# Altium project MM6108IQ MotherBoard.PrjPcb
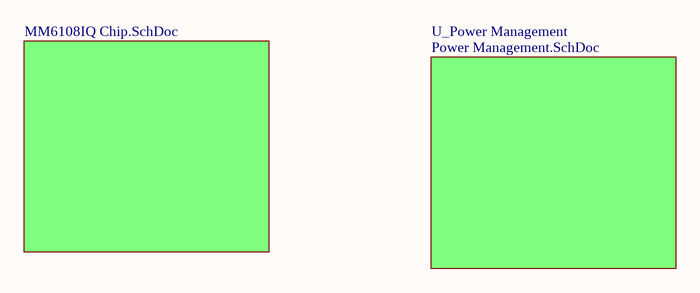
[diagram p0: MM6108IQ MotherBoard.SchDoc]
4 sheets, 74 parts. Net scope: flat (ports and power ports of the same name join across sheets).
Board file: MM6108IQ MotherBoard.PcbDoc
Sheets:
  MM6108IQ MotherBoard.SchDoc
    U_MM6108IQ MotherBoard = MM6108IQ Chip.SchDoc
    U_Power Management = Power Management.SchDoc
  Block Diagram.SchDoc

## Sheet MM6108IQ MotherBoard.SchDoc
size A; SheetNumber: 1; SheetTotal: 4

### Sub-sheets
U_MM6108IQ MotherBoard = MM6108IQ Chip.SchDoc: no entries
U_Power Management = Power Management.SchDoc: no entries

## Sheet MM6108IQ Chip.SchDoc
size 431 x 266 mm; SheetNumber: 2; SheetTotal: 4
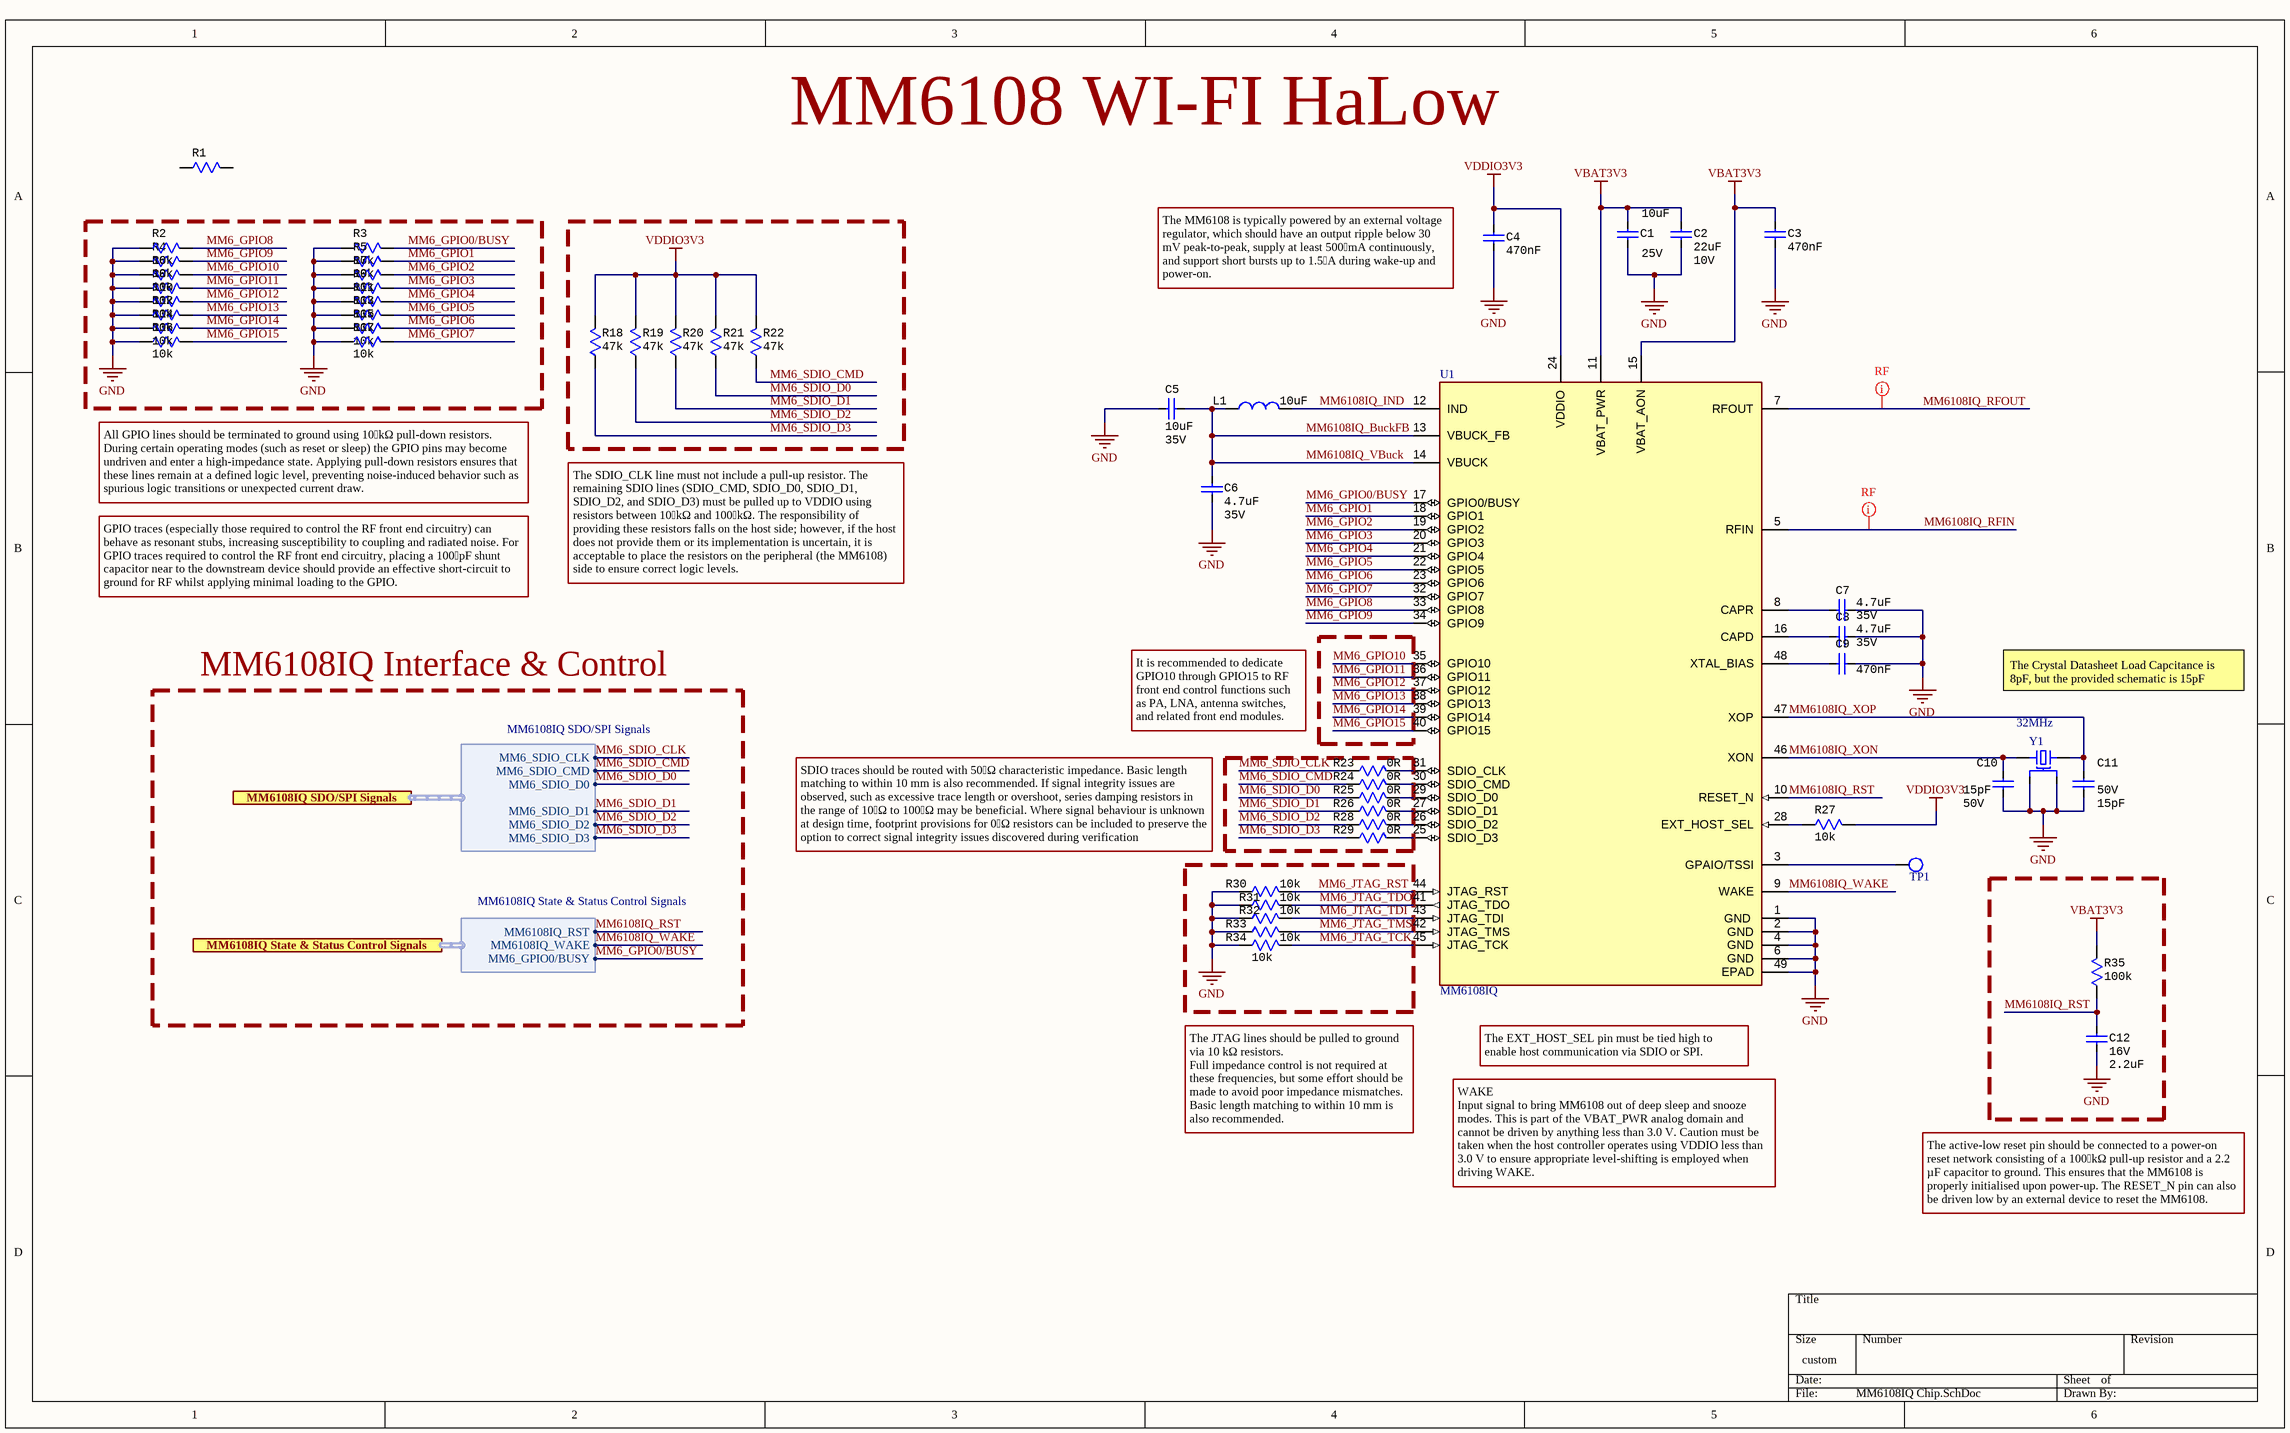
[diagram p1: MM6108IQ Chip.SchDoc]

### Parts
C1  Voltage: 25V  [CAP Ceramic SMD 0805]  (hidden comment: 10uF)
C2  Voltage: 10V  [CAP Ceramic SMD 0805]  (hidden comment: 22uF)
C3  470nF  [CAP Ceramic SMD 0603]
C4  470nF  [CAP Ceramic SMD 0603]
C5  Voltage: 35V  [CAP Ceramic SMD 0603]  (hidden comment: 10uF)
C6  value 4.7uF  Voltage: 35V  [CAP Ceramic SMD 0603]
C7  value 4.7uF  Voltage: 35V  [CAP Ceramic SMD 0603]
C8  value 4.7uF  Voltage: 35V  [CAP Ceramic SMD 0603]
C9  470nF  [CAP Ceramic SMD 0603]
C10  Voltage: 50V  [CAP Ceramic SMD 0603]  (hidden comment: 15pF)
C11  Voltage: 50V  [CAP Ceramic SMD 0603]  (hidden comment: 15pF)
C12  Voltage: 16V  [CAP Ceramic SMD 0603]  (hidden comment: 2.2uF)
L1  10uF  [IND SMD 1210]
R1  (no value)  [RES SMD 0603]
R2  10k  [RES SMD 0603]
R3  10k  [RES SMD 0603]
R4  10k  [RES SMD 0603]
R5  10k  [RES SMD 0603]
R6  10k  [RES SMD 0603]
R7  10k  [RES SMD 0603]
R8  10k  [RES SMD 0603]
R9  10k  [RES SMD 0603]
R10  10k  [RES SMD 0603]
R11  10k  [RES SMD 0603]
R12  10k  [RES SMD 0603]
R13  10k  [RES SMD 0603]
R14  10k  [RES SMD 0603]
R15  10k  [RES SMD 0603]
R16  10k  [RES SMD 0603]
R17  10k  [RES SMD 0603]
R18  value 47k  [RES SMD 0603]  (hidden comment: 47kR)
R19  value 47k  [RES SMD 0603]  (hidden comment: 47kR)
R20  value 47k  [RES SMD 0603]  (hidden comment: 47kR)
R21  value 47k  [RES SMD 0603]  (hidden comment: 47kR)
R22  value 47k  [RES SMD 0603]  (hidden comment: 47kR)
R23  0R  [RES SMD 0603]
R24  0R  [RES SMD 0603]
R25  0R  [RES SMD 0603]
R26  0R  [RES SMD 0603]
R27  10k  [RES SMD 0603]
R28  0R  [RES SMD 0603]
R29  0R  [RES SMD 0603]
R30  10k  [RES SMD 0603]
R31  10k  [RES SMD 0603]
R32  10k  [RES SMD 0603]
R33  10k  [RES SMD 0603]
R34  10k  [RES SMD 0603]
R35  100k  [RES SMD 0603]
TP1  TestPoint  [TestPoint Surface 0.8mm]  (value not drawn)  (no BOM)
U1  MM6108IQ  [QFN48 6x6]
Y1  32MHz  [XTAL_ECS-160-9-37-CKM-TR]

### Ports
MM6108IQ SDO/SPI Signals (harness MM6108IQ SDO/SPI Signals), MM6108IQ State & Status Control Signals (harness MM6108IQ State & Status Control Signals)

### Harnesses
MM6108IQ SDO/SPI Signals: MM6_SDIO_CLK, MM6_SDIO_CMD, MM6_SDIO_D0, MM6_SDIO_D3, MM6_SDIO_D2, MM6_SDIO_D1
MM6108IQ State & Status Control Signals: MM6108IQ_RST, MM6108IQ_WAKE, MM6_GPIO0/BUSY

### Nets
GND: C1.2 C2.2 C3.2 C4.1 C5.1 C6.2 C7.2 C8.2 C9.2 C10.2 C11.2 C12.2 R2.1 R3.1 R4.1 R5.1 R6.1 R7.1 R8.1 R9.1 R10.1 R11.1 R12.1 R13.1 R14.1 R15.1 R16.1 R17.1 R30.1 R31.1 R32.1 R33.1 R34.1 U1.1(GND) U1.2(GND) U1.4(GND) U1.6(GND) U1.49(EPAD) Y1.2(NC) Y1.4
VBAT3V3: C1.1 C2.1 C3.1 R35.2 U1.11(VBAT_PWR) U1.15(VBAT_AON)
VDDIO3V3: C4.2 R18.2 R19.2 R20.2 R21.2 R22.2 R27.2 U1.24(VDDIO)
MM6_GPIO0/BUSY: R3.2 U1.17(GPIO0/BUSY) ; port MM6108IQ State & Status Control Signals.MM6_GPIO0/BUSY
MM6_GPIO1: R5.2 U1.18(GPIO1)
MM6_GPIO2: R7.2 U1.19(GPIO2)
MM6_GPIO3: R9.2 U1.20(GPIO3)
MM6_GPIO4: R11.2 U1.21(GPIO4)
MM6_GPIO5: R13.2 U1.22(GPIO5)
MM6_GPIO6: R15.2 U1.23(GPIO6)
MM6_GPIO7: R17.2 U1.32(GPIO7)
MM6_GPIO8: R2.2 U1.33(GPIO8)
MM6_GPIO9: R4.2 U1.34(GPIO9)
MM6_GPIO10: R6.2 U1.35(GPIO10)
MM6_GPIO11: R8.2 U1.36(GPIO11)
MM6_GPIO12: R10.2 U1.37(GPIO12)
MM6_GPIO13: R12.2 U1.38(GPIO13)
MM6_GPIO14: R14.2 U1.39(GPIO14)
MM6_GPIO15: R16.2 U1.40(GPIO15)
MM6_JTAG_RST: R30.2 U1.44(JTAG_RST)
MM6_JTAG_TCK: R34.2 U1.45(JTAG_TCK)
MM6_JTAG_TDI: R32.2 U1.43(JTAG_TDI)
MM6_JTAG_TDO: R31.2 U1.41(JTAG_TDO)
MM6_JTAG_TMS: R33.2 U1.42(JTAG_TMS)
MM6_SDIO_CLK: R23.1 ; port MM6108IQ SDO/SPI Signals.MM6_SDIO_CLK
MM6_SDIO_CMD: R22.1 R24.1 ; port MM6108IQ SDO/SPI Signals.MM6_SDIO_CMD
MM6_SDIO_D0: R21.1 R25.1 ; port MM6108IQ SDO/SPI Signals.MM6_SDIO_D0
MM6_SDIO_D1: R20.1 R26.1 ; port MM6108IQ SDO/SPI Signals.MM6_SDIO_D1
MM6_SDIO_D2: R19.1 R28.1 ; port MM6108IQ SDO/SPI Signals.MM6_SDIO_D2
MM6_SDIO_D3: R18.1 R29.1 ; port MM6108IQ SDO/SPI Signals.MM6_SDIO_D3
MM6108IQ_BuckFB: C5.2 C6.1 L1.2 U1.13(VBUCK_FB) U1.14(VBUCK)  [also labelled MM6108IQ_VBuck]
MM6108IQ_IND: L1.1 U1.12(IND)
MM6108IQ_RFIN: U1.5(RFIN)
MM6108IQ_RFOUT: U1.7(RFOUT)
MM6108IQ_RST: C12.1 R35.1 U1.10(RESET_N) ; port MM6108IQ State & Status Control Signals.MM6108IQ_RST
MM6108IQ_WAKE: U1.9(WAKE) ; port MM6108IQ State & Status Control Signals.MM6108IQ_WAKE
MM6108IQ_XON: C10.1 U1.46(XON) Y1.1
MM6108IQ_XOP: C11.1 U1.47(XOP) Y1.3
NetC7_1: C7.1 U1.8(CAPR)
NetC8_1: C8.1 U1.16(CAPD)
NetC9_1: C9.1 U1.48(XTAL_BIAS)
NetR23_2: R23.2 U1.31(SDIO_CLK)
NetR24_2: R24.2 U1.30(SDIO_CMD)
NetR25_2: R25.2 U1.29(SDIO_D0)
NetR26_2: R26.2 U1.27(SDIO_D1)
NetR27_1: R27.1 U1.28(EXT_HOST_SEL)
NetR28_2: R28.2 U1.26(SDIO_D2)
NetR29_2: R29.2 U1.25(SDIO_D3)
NetTP1_1: TP1.1 U1.3(GPAIO/TSSI)

Not connected (* = marked no-connect by the designer): R1 1 2

### Layout directives
net class RF: MM6108IQ_RFIN, MM6108IQ_RFOUT

### Notes on the sheet
- MM6108 WI-FI HaLow
- (near C4) The MM6108 is typically powered by an external voltage regulator, which should have an output ripple below 30 mV peak-to-peak, supply at least 500 mA continuously, and support short bursts up to 1.5 A during wake-up and power-on.
- All GPIO lines should be terminated to ground using 10 kΩ pull-down resistors. During certain operating modes (such as reset or sleep) the GPIO pins may become undriven and enter a high-impedance state. Applying pull-down resistors ensures that these lines remain at a defined logic level, preventing noise-induced behavior such as spurious logic transitions or unexpected current draw.
- The SDIO_CLK line must not include a pull-up resistor. The remaining SDIO lines (SDIO_CMD, SDIO_D0, SDIO_D1, SDIO_D2, and SDIO_D3) must be pulled up to VDDIO using resistors between 10 kΩ and 100 kΩ. The responsibility of providing these resistors falls on the host side; however, if the host does not provide them or its implementation is uncertain, it is acceptable to place the resistors on the peripheral (the MM6108) side to ensure correct logic levels.
- GPIO traces (especially those required to control the RF front end circuitry) can behave as resonant stubs, increasing susceptibility to coupling and radiated noise. For GPIO traces required to control the RF front end circuitry, placing a 100 pF shunt capacitor near to the downstream device should provide an effective short-circuit to ground for RF whilst applying minimal loading to the GPIO.
- MM6108IQ Interface & Control
- The Crystal Datasheet Load Capcitance is 8pF, but the provided schematic is 15pF
- It is recommended to dedicate GPIO10 through GPIO15 to RF front end control functions such as PA, LNA, antenna switches, and related front end modules.
- SDIO traces should be routed with 50 Ω characteristic impedance. Basic length matching to within 10 mm is also recommended. If signal integrity issues are observed, such as excessive trace length or overshoot, series damping resistors in the range of 10 Ω to 100 Ω may be beneficial. Where signal behaviour is unknown at design time, footprint provisions for 0 Ω resistors can be included to preserve the option to correct signal integrity issues discovered during verification
- The EXT_HOST_SEL pin must be tied high to enable host communication via SDIO or SPI.
- The JTAG lines should be pulled to ground via 10 kΩ resistors.
  Full impedance control is not required at these frequencies, but some effort should be made to avoid poor impedance mismatches. Basic length matching to within 10 mm is also recommended.
- WAKE
  Input signal to bring MM6108 out of deep sleep and snooze modes. This is part of the VBAT_PWR analog domain and cannot be driven by anything less than 3.0 V. Caution must be taken when the host controller operates using VDDIO less than 3.0 V to ensure appropriate level-shifting is employed when driving WAKE.
- The active-low reset pin should be connected to a power-on reset network consisting of a 100 kΩ pull-up resistor and a 2.2 µF capacitor to ground. This ensures that the MM6108 is properly initialised upon power-up. The RESET_N pin can also be driven low by an external device to reset the MM6108.

### Library data of the parts
C1 = CAP 0805 10uF 25V 10%: CAP CER 10uF 25V X7R 0805; Manufacturer: Samsung Electro-Mechanics; Manufacturer Part Number: CL21B106KAYQNNE; Tolerance: 10%; Supplier: LCSC; RoHS: Yes; Category: Ceramic Capacitors; Mount: Surface Mount; Capacitance: 10uF; Supplier Part Number: C3039694; Value: 10uF
C2 = CAP 0805 22uF 10V: CAP CER 22uF 10V X7R 0805; Manufacturer: muRata; Manufacturer Part Number: GRM21BZ71A226ME15L; Tolerance: 20%; Supplier: LCSC; RoHS: Yes; Category: Ceramic Capacitors; Stock 1: 663420; Pricing 1: 20=0.033200, 200=0.025500, 600=0.022100, 2000=0.019600, 10000=0.018600, 20000=0.017900 (AUD); Mount: Surface Mount; Case/Package: 0805; Case Code (Metric): 3216; Case Code (Imperial): 0805; Min Operating Temperature: -55°C; Max Operating Temperature: 125°C; Capacitance: 22uF; Dielectric: X7R; Packaging: Tape and Reel; Voltage Rating: 10V; Package Quantity: 1; Series: CL; Construction: Flat; Length: 3.2mm; Width: 0.063inch; Height: 1.6mm; Thickness: 0.071inch; Depth: 1.6mm; Radiation Hardening: No; RoHS Compliant: Yes; Supplier Part Number: C907991; Value: 22uF
C3 C4 C9 = CAP 0603 470nF 25V: 470nF ±10% 25V Ceramic Capacitor X7R 0603; Manufacturer: Samsung Electro-Mechanics; Manufacturer Part Number: CL10B474KA8NNNC; Dissipation Factor: 2.5%; Insulation Resistance: 10GR; Voltage: 50V; Depth: 0.8mm; Capacitance: 470nF; Case Code (Imperial): 0603; Case Code (Metric): 1608; Case/Package: 0603; Category: Ceramic Capacitors; Dielectric: X7R; Dielectric Material: Ceramic; Halogen Free: Halogen Free; Height: 0.8mm; Lead Free: Lead Free; Length: 1.6mm; Material: Ceramic; Max Operating Temperature: 125°C; Min Operating Temperature: -55°C; Mount: Surface Mount; Number of Pins: 2; Package Quantity: 1; Packaging: Tape and Reel; Radiation Hardening: No; Resistor Type: Ceramic; RoHS Compliant: Yes; Series: CC; Termination: SMD/SMT; Thickness: 0.035inch; Tolerance: 10%; Voltage Rating: 50V; Voltage Rating (DC): 50V; Width: 0.031inch; Supplier: LCSC; Supplier Part Number: C1623
C5 = CAP 0603 10uF 35V: Cap Ceramic 10uF 35V X5R 20% Pad SMD 0603 85C T/R; Manufacturer: Murata; Manufacturer Part Number: GRM188R6YA106MA73D; Supplier: LCSC; RoHS: Yes; Category: Ceramic Capacitors; Mount: Surface Mount; Case/Package: 0603; Case Code (Metric): 1608; Case Code (Imperial): 0603; Min Operating Temperature: -55°C; Max Operating Temperature: 85°C; Packaging: Tape and Reel; Capacitance: 10uF; Voltage Rating: 35V; Tolerance: 20%; Dielectric: X5R; Voltage Rating (DC): 35V; Length: 0.063inch; Width: 0.031inch; Thickness: 0.039inch; RoHS Compliant: Yes; ComponentLink1URL: http://search.murata.co.jp/Ceramy/image/img/A01X/G101/ENG/GRM188R6YA106MA73-01.pdf?src-supplier=Future+Electronics; ComponentLink1Description: http://search.murata.co.jp/Ceramy/image/img/A01X/G101/ENG/GRM188R6YA106MA73-01.pdf?src-supplier=Future+Electronics; ComponentLink2URL: http://search.murata.co.jp/Ceramy/image/img/A01X/G101/ENG/GRM188R6YA106MA73-01.pdf?src-supplier=Digi-Key; ComponentLink2Description: http://search.murata.co.jp/Ceramy/image/img/A01X/G101/ENG/GRM188R6YA106MA73-01.pdf?src-supplier=Digi-Key; ComponentLink3URL: https://www.murata.com/~/media/webrenewal/support/library/catalog/products/capacitor/mlcc/c02e.ashx?la=en-us&src-supplier=Digi-Key; ComponentLink3Description: https://www.murata.com/~/media/webrenewal/support/library/catalog/products/capacitor/mlcc/c02e.ashx?la=en-us&src-supplier=Digi-Key; ComponentLink4URL: http://search.murata.co.jp/Ceramy/image/img/A01X/G101/ENG/GRM188R6YA106MA73-01.pdf?src-supplier=Mouser; ComponentLink4Description: http://search.murata.co.jp/Ceramy/image/img/A01X/G101/ENG/GRM188R6YA106MA73-01.pdf?src-supplier=Mouser; ComponentLink5URL: http://search.murata.co.jp/Ceramy/image/img/A01X/G101/ENG/GRM188R6YA106MA73-01.pdf?src-supplier=TTI; ComponentLink5Description: http://search.murata.co.jp/Ceramy/image/img/A01X/G101/ENG/GRM188R6YA106MA73-01.pdf?src-supplier=TTI; Supplier Part Number: C194427; Value: 10uF
C6-C8 = CAP 0603 4.7uF 25V X5R 10%: 25V 4.7uF X5R ±10% 0603 Multilayer Ceramic Capacitors MLCC - SMD/SMT ROHS; Manufacturer: Samsung Electro-Mechanics; Manufacturer Part Number: CL10A475KA8NQNC; Supplier: LCSC; Supplier Part Number: C69335; Temperature Characteristics Code: X5R
C10 C11 = CAP 0603 15pF 50V NP0 5%: 50V 15pF NP0 ±5% 0603 Multilayer Ceramic Capacitors MLCC - SMD/SMT ROHS; Manufacturer: Yageo; Manufacturer Part Number: CC0603JRNPO9BN150; Supplier Part Number: C107037; Supplier: LCSC; Value: 15pF
C12 = CAP 0603 2.2uF 16V: 16V 2.2uF X5R ±10% 0603 Multilayer Ceramic Capacitors MLCC - SMD/SMT ROHS; Manufacturer: YAGEO; Manufacturer Part Number: CC0603KRX5R7BB225; Supplier: LCSC; Supplier Part Number: C106853; Capacitance: 2.2uF
L1 = IND 1210 10uF 20% 2.2A: FIXED IND 10uH 2.2A 210mΩ 1210; Manufacturer: XR; Manufacturer Part Number: XRTC322512S100MBCA; Supplier: LCSC; Supplier Part Number: C39846661; Value: 10uF
R1-R17 R27 R30-R34 = RES 0603 10k 1%: 100mW Thick Film Resistors 75V ±100ppm/℃ ±1% 10kΩ 0603 Chip Resistor - Surface Mount ROHS; Manufacturer: YAGEO; Manufacturer Part Number: RC0603FR-0710KL; Supplier: LCSC; Supplier Part Number: C98220
  R2-R17 R27 R30-R34: Value: 10k
R18-R22 = RES 0603 47k 1%: Res Thick Film 0603 47K Ohm 1% 1/10W ±100ppm/°C Molded SMD Punched Carrier T/R; Manufacturer: YAGEO; Manufacturer Part Number: RC0603FR-0747KL; Max Power Dissipation: 100mW; Voltage Rating: 75V; Working Voltage: 6V; Supplier: LCSC; RoHS: Yes; Category: Chip SMD Resistors; Stock 1: 88700; Pricing 1: 50=0.011700, 500=0.009700, 1500=0.008600, 5000=0.008000, 25000=0.007400, 50000=0.007100 (AUD); Mount: Surface Mount; Case/Package: 0603; Number of Pins: 2; Case Code (Metric): 1608; Case Code (Imperial): 0603; Contact Plating: Tin; Min Operating Temperature: -55°C; Max Operating Temperature: 155°C; Resistance: 47kR; Tolerance: 1%; Packaging: Tape and Reel; Temperature Coefficient: 100ppm/°C; Resistor Type: Thick Film; Number of Terminations: 2; Power Rating: 100mW; Series: ERJ; Package Quantity: 5000; Voltage Rating (DC): 75V; Features: Automotive AEC-Q200; Termination: SMD/SMT; Construction: Rectangular; Resistance Tolerance: 1%; Technology: THICK FILM; Length: 1.6mm; Width: 0.8mm; Height: 0.45mm; Depth: 0.8mm; Radiation Hardening: No; RoHS Compliant: Yes; Lead Free: Lead Free; Military Standard: Not; REACH SVHC: No SVHC; ComponentLink1URL: https://datasheet.ciiva.com/6138/aoa0000ce2-6138149.pdf?src-supplier=Farnell; ComponentLink1Description: https://datasheet.ciiva.com/6138/aoa0000ce2-6138149.pdf?src-supplier=Farnell; ComponentLink2URL: https://datasheet.ciiva.com/7802/aoa0000ce2-7802421.pdf?src-supplier=Element14; ComponentLink2Description: https://datasheet.ciiva.com/7802/aoa0000ce2-7802421.pdf?src-supplier=Element14; ComponentLink3URL: https://datasheet.ciiva.com/46398/1678782-46398088.pdf?src-supplier=Element14; ComponentLink3Description: https://datasheet.ciiva.com/46398/1678782-46398088.pdf?src-supplier=Element14; ComponentLink4URL: https://datasheet.ciiva.com/22722/426256-22722781.pdf?src-supplier=Element14; ComponentLink4Description: https://datasheet.ciiva.com/22722/426256-22722781.pdf?src-supplier=Element14; ComponentLink5URL: https://datasheet.ciiva.com/46398/1678782-46398089.pdf?src-supplier=Element14; ComponentLink5Description: https://datasheet.ciiva.com/46398/1678782-46398089.pdf?src-supplier=Element14; ComponentLink6URL: https://datasheet.ciiva.com/24069/aoa0000ce2-24069209.pdf?src-supplier=Mouser; ComponentLink6Description: https://datasheet.ciiva.com/24069/aoa0000ce2-24069209.pdf?src-supplier=Mouser; ComponentLink7URL: https://datasheet.ciiva.com/16758/70260748-16758831.pdf?src-supplier=Allied+Electronics; ComponentLink7Description: https://datasheet.ciiva.com/16758/70260748-16758831.pdf?src-supplier=Allied+Electronics; ComponentLink8URL: https://datasheet.ciiva.com/48531/aoa0000ce2-48531029.pdf?src-supplier=Avnet; ComponentLink8Description: https://datasheet.ciiva.com/48531/aoa0000ce2-48531029.pdf?src-supplier=Avnet; ComponentLink9URL: https://datasheet.ciiva.com/30236/aoa0000ce2-30236698.pdf?src-supplier=Onlinecomponents.com; ComponentLink9Description: https://datasheet.ciiva.com/30236/aoa0000ce2-30236698.pdf?src-supplier=Onlinecomponents.com; Supplier Part Number: C105579
R23-R26 R28 R29 = RES 0603 0R 1%: 100mW Thick Film Resistors 75V ±5% 0Ω 0603 Chip Resistor - Surface Mount ROHS; Manufacturer: YAGEO; Manufacturer Part Number: RC0603JR-070RL; Supplier: LCSC; Supplier Part Number: C95177; Value: 0R
R35 = RES 0603 100k 1%: 100mW Thick Film Resistors 75V ±100ppm/℃ ±1% 100kΩ 0603 Chip Resistor - Surface Mount ROHS; Manufacturer: YAGEO; Manufacturer Part Number: RC0603FR-07100KL; Supplier Part Number: C14675; Supplier: LCSC; Value: 100k
U1 = MM6108IQ: Wi-Fi HaLow (pronounced HEYlow) is the first global Wi-Fi standard (IEEE 802.11ah) tailored to meet the / Internet of Things (IoT) needs. It’s an open standard wireless network technology operating in the sub-1 GHz / license-exempt RF bands (850-950 MHz range); Manufacturer: Morse Micro; Manufacturer Part Number: MM6108IQ; Supplier: *; Supplier Part Number: *
Y1 = ECS-320-8-37B-CKY-TR: CRYSTAL 32MHz 8pF SMD; Manufacturer: ECS; Manufacturer Part Number: ECS-320-8-37B-CKY-TR; Supplier: LCSC; Supplier Part Number: C2636238

## Sheet Power Management.SchDoc
size 381 x 241 mm; SheetNumber: 3; SheetTotal: 4
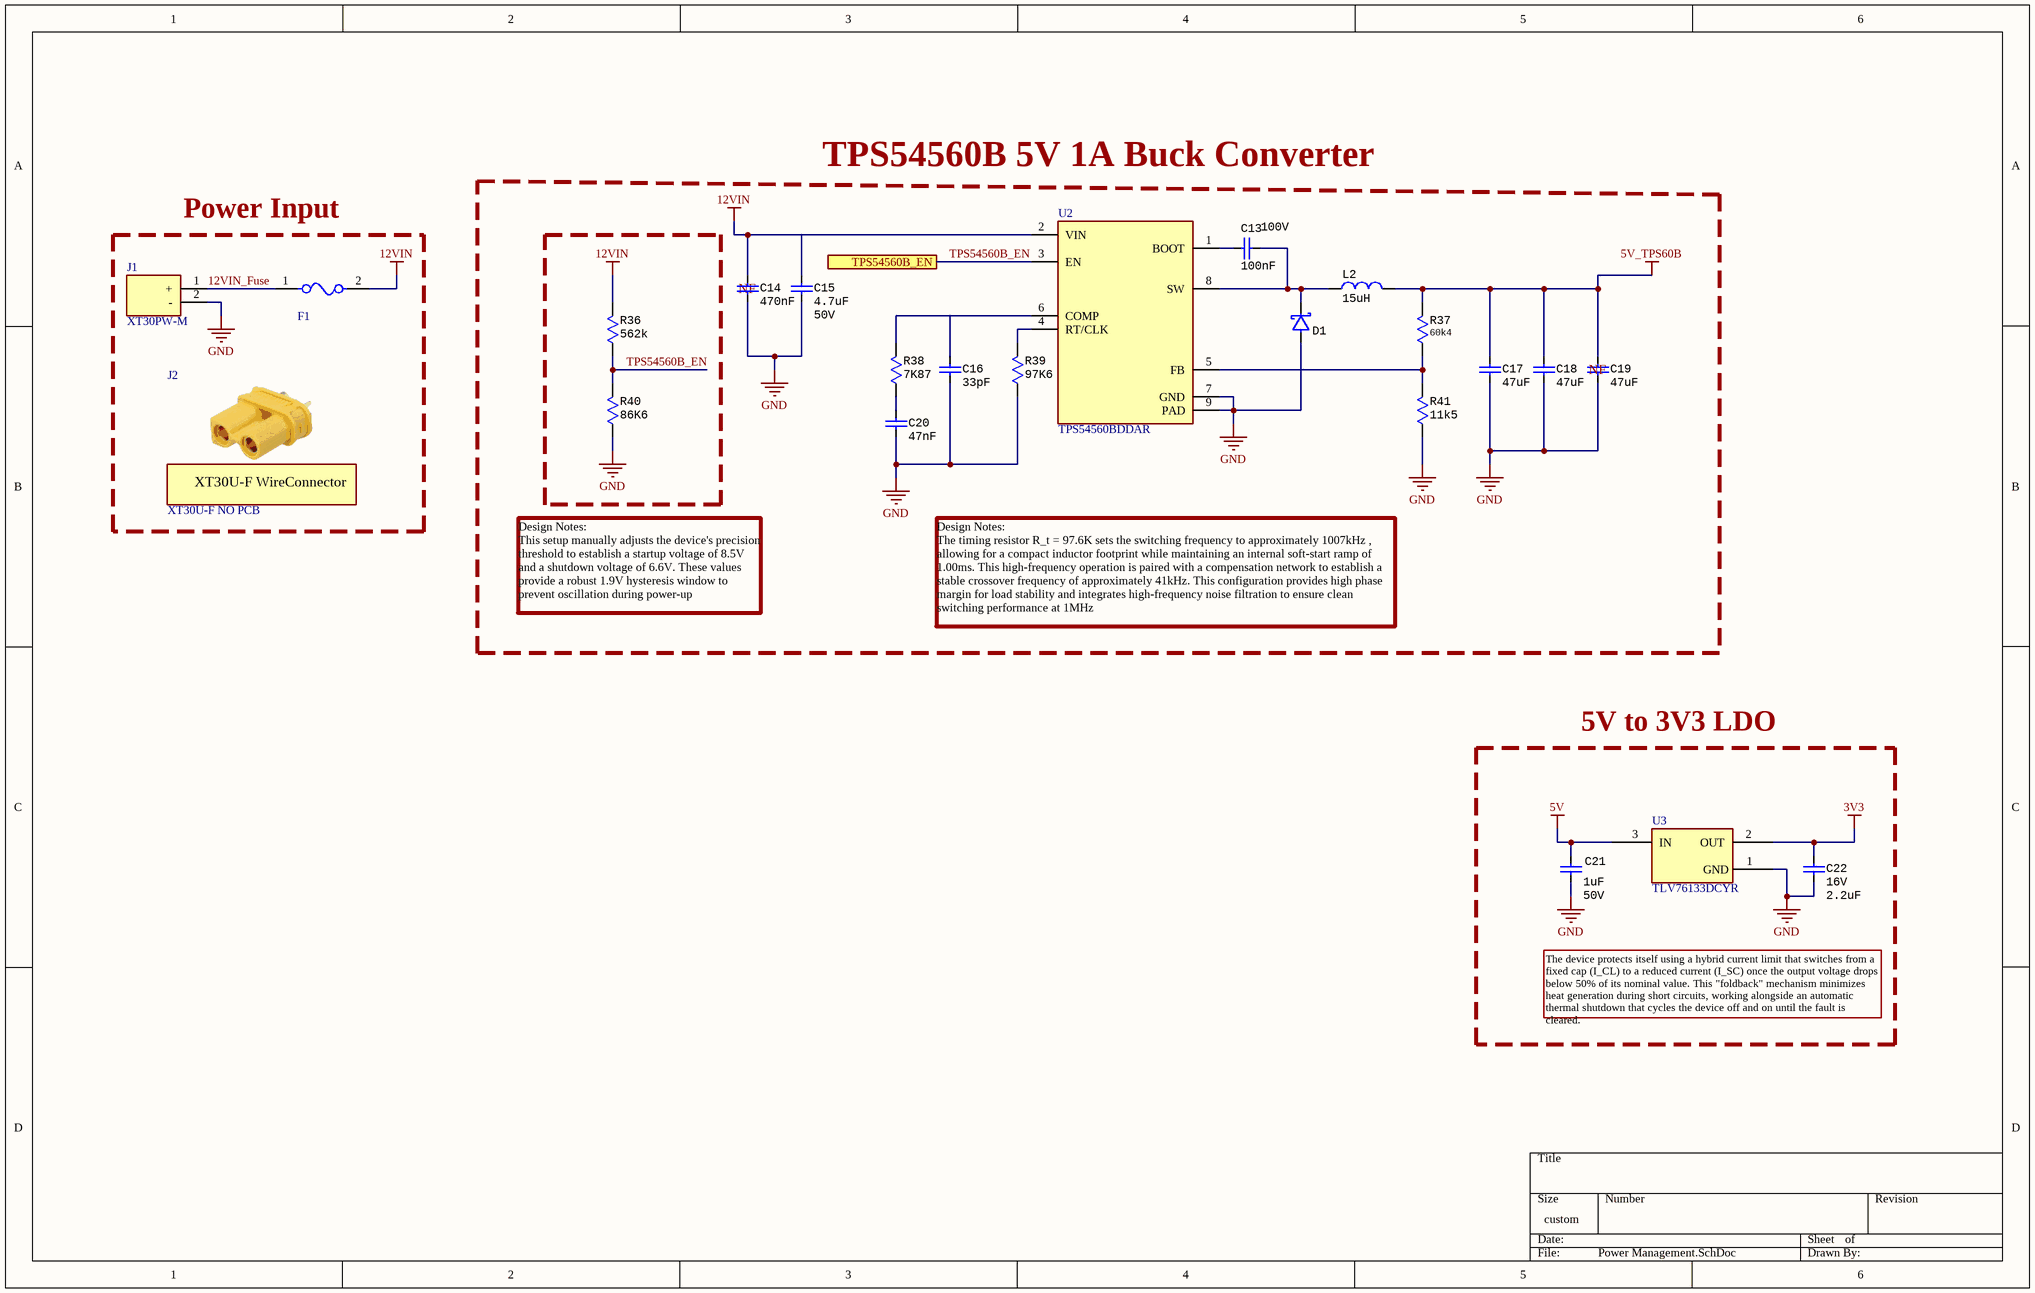
[diagram p2: Power Management.SchDoc]

### Parts
C13  value 100nF  Voltage: 100V  [CAP Ceramic SMD 0603]
C14  470nF  [CAP Ceramic SMD 0603]
C15  value 4.7uF  Voltage: 50V  [CAP Ceramic SMD 1206]
C16  33pF  [CAP Ceramic SMD 0402]
C17  47uF  [CAP Ceramic SMD 1210]
C18  47uF  [CAP Ceramic SMD 1210]
C19  47uF  [CAP Ceramic SMD 1210]
C20  47nF  [CAP Ceramic SMD 0402]
C21  value 1uF  Voltage: 50V  [CAP Ceramic SMD 0603]
C22  Voltage: 16V  [CAP Ceramic SMD 0603]  (hidden comment: 2.2uF)
D1  B360A-13-F  [DO-214AB]  (value not drawn)
F1  0452.500MRL  [Fuse SMD 2410 MFG]  (value not drawn)
J1  XT30PW-M  [XT30PW-M]
J2  XT30U-F NO PCB  (mechanical)
L2  15uH  [IND SMD VLS6045EX]
R36  562k  [RES SMD 0603]
R37  60k4  [RES SMD 0603]
R38  7K87  [CAP Ceramic SMD 0402]
R39  97K6  [RES SMD 0603]
R40  86K6  [RES SMD 0603]
R41  11k5  [RES SMD 0603]
U2  TPS54560BDDAR  [LMR14050]
U3  TLV76133DCYR  [SOT-223]

### Ports
TPS54560B_EN

### Nets
3V3: C22.1 U3.2(OUT)
5V: C21.1 U3.3(IN)
5V_TPS60B: C17.1 C18.1 C19.1 L2.1 R37.2
12VIN: C14.1 C15.1 F1.2 R36.2 U2.2(VIN)
GND: C14.2 C15.2 C16.2 C17.2 C18.2 C19.2 C20.2 C21.2 C22.2 D1.1 J1.2(-) R39.1 R40.1 R41.1 U2.7(GND) U2.9(PAD) U3.1(GND)
12VIN_Fuse: F1.1 J1.1(+)
TPS54560B_EN: R36.1 R40.2 U2.3(EN) ; port TPS54560B_EN
NetC13_1: C13.1 U2.1(BOOT)
NetC13_2: C13.2 D1.2 L2.2 U2.8(SW)
NetC16_1: C16.1 R38.2 U2.6(COMP)
NetC20_1: C20.1 R38.1
NetR37_1: R37.1 R41.2 U2.5(FB)
NetR39_2: R39.2 U2.4(RT/CLK)

### Notes on the sheet
- TPS54560B 5V 1A Buck Converter
- Power Input
- (near C14) NF
- (near C19) NF
- Design Notes:
  This setup manually adjusts the device's precision threshold to establish a startup voltage of 8.5V and a shutdown voltage of 6.6V. These values provide a robust 1.9V hysteresis window to prevent oscillation during power-up
- Design Notes:
  The timing resistor R_t = 97.6K sets the switching frequency to approximately 1007kHz , allowing for a compact inductor footprint while maintaining an internal soft-start ramp of 1.00ms. This high-frequency operation is paired with a compensation network to establish a stable crossover frequency of approximately 41kHz. This configuration provides high phase margin for load stability and integrates high-frequency noise filtration to ensure clean switching performance at 1MHz
- 5V to 3V3 LDO
- The device protects itself using a hybrid current limit that switches from a fixed cap (I_CL) to a reduced current (I_SC) once the output voltage drops below 50% of its nominal value. This "foldback" mechanism minimizes heat generation during short circuits, working alongside an automatic thermal shutdown that cycles the device off and on until the fault is cleared.
- (in symbol XT30U-F NO PCB) XT30U-F WireConnector

### Library data of the parts
C13 = CAP 0603 100nF 100V X7R 10%: 100V 100nF X7R ±10% 0603 Multilayer Ceramic Capacitors MLCC - SMD/SMT ROHS; Manufacturer: Yageo; Manufacturer Part Number: CC0603KRX7R0BB104; Supplier: LCSC; Supplier Part Number: C113803; Temperature Characteristics Code: X7R
C14 = CAP 0603 470nF 25V: as C3 on sheet MM6108IQ Chip; Depth: 0.8mm; Capacitance: 470nF; Case Code (Imperial): 0603; Case Code (Metric): 1608; Case/Package: 0603; Category: Ceramic Capacitors; Dielectric: X7R; Dielectric Material: Ceramic; Halogen Free: Halogen Free; Height: 0.8mm; Lead Free: Lead Free; Length: 1.6mm; Material: Ceramic; Max Operating Temperature: 125°C; Min Operating Temperature: -55°C; Mount: Surface Mount; Number of Pins: 2; Package Quantity: 1; Packaging: Tape and Reel; Radiation Hardening: No; Resistor Type: Ceramic; RoHS Compliant: Yes; Series: CC; Termination: SMD/SMT; Thickness: 0.035inch; Tolerance: 10%; Voltage Rating: 50V; Voltage Rating (DC): 50V; Width: 0.031inch; Supplier: LCSC; Supplier Part Number: C1623
C15 = CAP 1206 4.7uF 50V X7R: CAP CER 4.7uF 50V X7R 1206; Manufacturer: Samsung Electro-Mechanics; Manufacturer Part Number: CL31B475KBHNNNE; Supplier: LCSC; Supplier Part Number: C51205
C16 = CAP 0402 33pF 50V C0G: CAP CER 33pF 50V C0G 0402; Manufacturer: Samsung Electro-Mechanics; Manufacturer Part Number: GRM155R71E473KA88D; Capacitance: 33pF; Supplier: LCSC; Supplier Part Number: C70465; Voltage: 50V
C17-C19 = CAP 1210 47uF 10V X7R: 47uF ±10% 10V Ceramic Capacitor X7R 1210; Manufacturer: muRata; Manufacturer Part Number: GRM32ER71A476KE15L; Supplier: LCSC; Supplier Part Number: C84494; Case/Package: 1210; Value: 47uF; Temperature Characteristics Code: X7R; Voltage Rating: 10V
C20 = CAP 0402 47nF 25V: CAP CER 47nF 25V X7R 0402; Manufacturer: muRata; Manufacturer Part Number: GRM155R71E473KA88D; Dielectric Material: Ceramic; Dissipation Factor: 2.5%; Insulation Resistance: 10GR; Tolerance: 10%; Depth: 0.8mm; Capacitance: 47nF; Case Code (Imperial): 0603; Case Code (Metric): 1608; Case/Package: 0402; Category: Ceramic Capacitors; Dielectric: X7R; Halogen Free: Halogen Free; Height: 0.8mm; Lead Free: Lead Free; Length: 1.6mm; Material: Ceramic; Max Operating Temperature: 125°C; Min Operating Temperature: -55°C; Mount: Surface Mount; Number of Pins: 2; Package Quantity: 1; Packaging: Tape and Reel; Radiation Hardening: No; Resistor Type: Ceramic; RoHS Compliant: Yes; Series: CC; Termination: SMD/SMT; Thickness: 0.035inch; Voltage: 25V; Voltage Rating: 25V; Voltage Rating (DC): 25V; Width: 0.031inch; Supplier: LCSC; Supplier Part Number: C77017
C21 = CAP 0603 1uF 50V X7R 10%: 50V 1uF X7R ±10% 0603 Multilayer Ceramic Capacitors MLCC - SMD/SMT ROHS; Manufacturer: YAGEO; Manufacturer Part Number: CC0603KRX7R9BB105; Supplier: LCSC; Temperature Characteristics Code: X7R; Supplier Part Number: C559769
C22 = CAP 0603 2.2uF 16V: as C12 on sheet MM6108IQ Chip; Supplier: LCSC; Supplier Part Number: C106853; Capacitance: 2.2uF
D1 = DIODES B560C-13-F: Voltage： 60V Current： 5A; Manufacturer: DIODES; Manufacturer Part Number: B560C-13-F; Supplier: LCSC; Supplier Part Number: C85100
F1 = Littelfuse 0452.500MRL: FUSE BRD MNT 500mA 125VAC/VDC 2410; Manufacturer: Littelfuse; Manufacturer Part Number: 0452.500MRL; Supplier: LCSC; Supplier Part Number: C151120
J1 = XT30PW-M: Power Connectors ROHS; Manufacturer: Changzhou Amass Elec; Manufacturer Part Number: XT30PW-M30.G.Y; Supplier: LCSC; Supplier Part Number: C431092
J2 = XT30U-F NO PCB: Power Connectors ROHS; Manufacturer: Changzhou Amass Elec; Manufacturer Part Number: XT30U-F; Supplier: LCSC; Supplier Part Number: C99102
L2 = IND 6X6mm 15uF 20%_1: FIXED IND 15uH 2.5A 75mΩ SMD,6x6mm; Manufacturer: TDK; Manufacturer Part Number: VLS6045EX-150M; Suppleir Part Number: C404502; Supplier: LCSC
R36 = RES 0603 562k 1%: 100mW 562kΩ 75V Thick Film Resistor ±100ppm/℃ ±1% 0603 Chip Resistor - Surface Mount RoHS; Manufacturer: YAGEO; Manufacturer Part Number: RC0603FR-07562KL; Supplier: LCSC; Supplier Part Number: C185319; Value: 562k
R37 = RES 0603 60k4 1%: RES 60.4kΩ ±1% 100mW 0603; Manufacturer: Yageo; Manufacturer Part Number: RC0603FR-0760K4L; Voltage Rating: 50V; Temperature Coefficient: 100ppm/°C; Resistance: 60k4; Supplier: LCSC; Supplier Part Number: C165742; RoHS: Yes; Category: Chip SMD Resistors; Stock: 51500; Pricing: 100=0.0013 (USD); Case/Package: 0603; Number of Pins: 2; Case Code (Metric): 1608; Case Code (Imperial): 0603; Size Code: 0603; Min Operating Temperature: -55°C; Max Operating Temperature: 155°C; Package Quantity: 1; Power Rating: 100mW; Tolerance: 1%; Packaging: Tape and Reel; Voltage Rating (DC): 50V; Resistor Type: Thick Film; Number of Terminations: 2; Termination: SMD/SMT; Max Power Dissipation: 100mW; Features: Moisture Resistant; Series: RC; Resistance Tolerance: 1%; Technology: THICK FILM; Construction: Rectangular; Length: 1.6mm; Width: 0.8mm; Height: 0.45mm; Depth: 0.8mm; Military Standard: Not; Lead Free: Lead Free; RoHS Compliant: Yes
R38 = RES 0402 7k87 1%: RES 7.87kΩ ±1% 62.5mW 0402; Manufacturer: YAGEO; Manufacturer Part Number: RC0402FR-077K87L; Max Power Dissipation: 100mW; Supplier: LCSC; Resistance: 7K87; Tolerance: 1%; Supplier Part Number: C185394; Stock 2: 800; Pricing 2: 50=0.009200, 500=0.007300, 1500=0.006200, 5000=0.005500, 25000=0.005000, 50000=0.004700 (AUD); Contact Plating: Tin; Number of Terminations: 2; Series: ERJ; Package Quantity: 1; Features: Automotive AEC-Q200; Construction: Rectangular; Resistance Tolerance: 1%; Technology: THICK FILM; Width: 0.031inch; Radiation Hardening: No; Lead Free: Lead Free; Value: 7K87
R39 = RES 0603 97k6 1%: 97.6kΩ 100mW 75V Thick Film Resistor ±100ppm/℃ ±1% 0603 Chip Resistor - Surface Mount RoHS; Manufacturer: YAGEO; Manufacturer Part Number: AC0603FR-0797K6L; Supplier: LCSC; Supplier Part Number: C228109; Value: 97K6
R40 = RES 0603 86k6 1%: RES 86.6kΩ ±1% 100mW 0603; Manufacturer: YAGEO; Manufacturer Part Number: RC0603FR-0786K6L; Supplier Part Number: C141683; Supplier: LCSC; Resistance: 86K6
R41 = RES 0603 11k5 1%: RES 11.5kΩ ±1% 100mW 0603; Manufacturer: YAGEO; Manufacturer Part Number: RC0603FR-0711K5L; Supplier Part Number: C137802; Supplier: LCSC; Resistance: 11k5
U2 = TPS54560BDDAR: 4.5V to 60V input, 5A step-down DC/DC converter; Manufacturer: TI; Manufacturer Part Number: TPS54560BDDAR; Supplier: LCSC; Supplier Part Number: C1850354
U3 = TLV76133DCYR: 3V3 Linear Voltage Regulator IC Positive Fixed 1 Output 1A SOT-223; Manufacturer: TI; Manufacturer Part Number: TLV76133DCYR; Supplier: LCSC; Supplier Part Number: C7527500

## Sheet Block Diagram.SchDoc
size A4; SheetNumber: 4; SheetTotal: 4
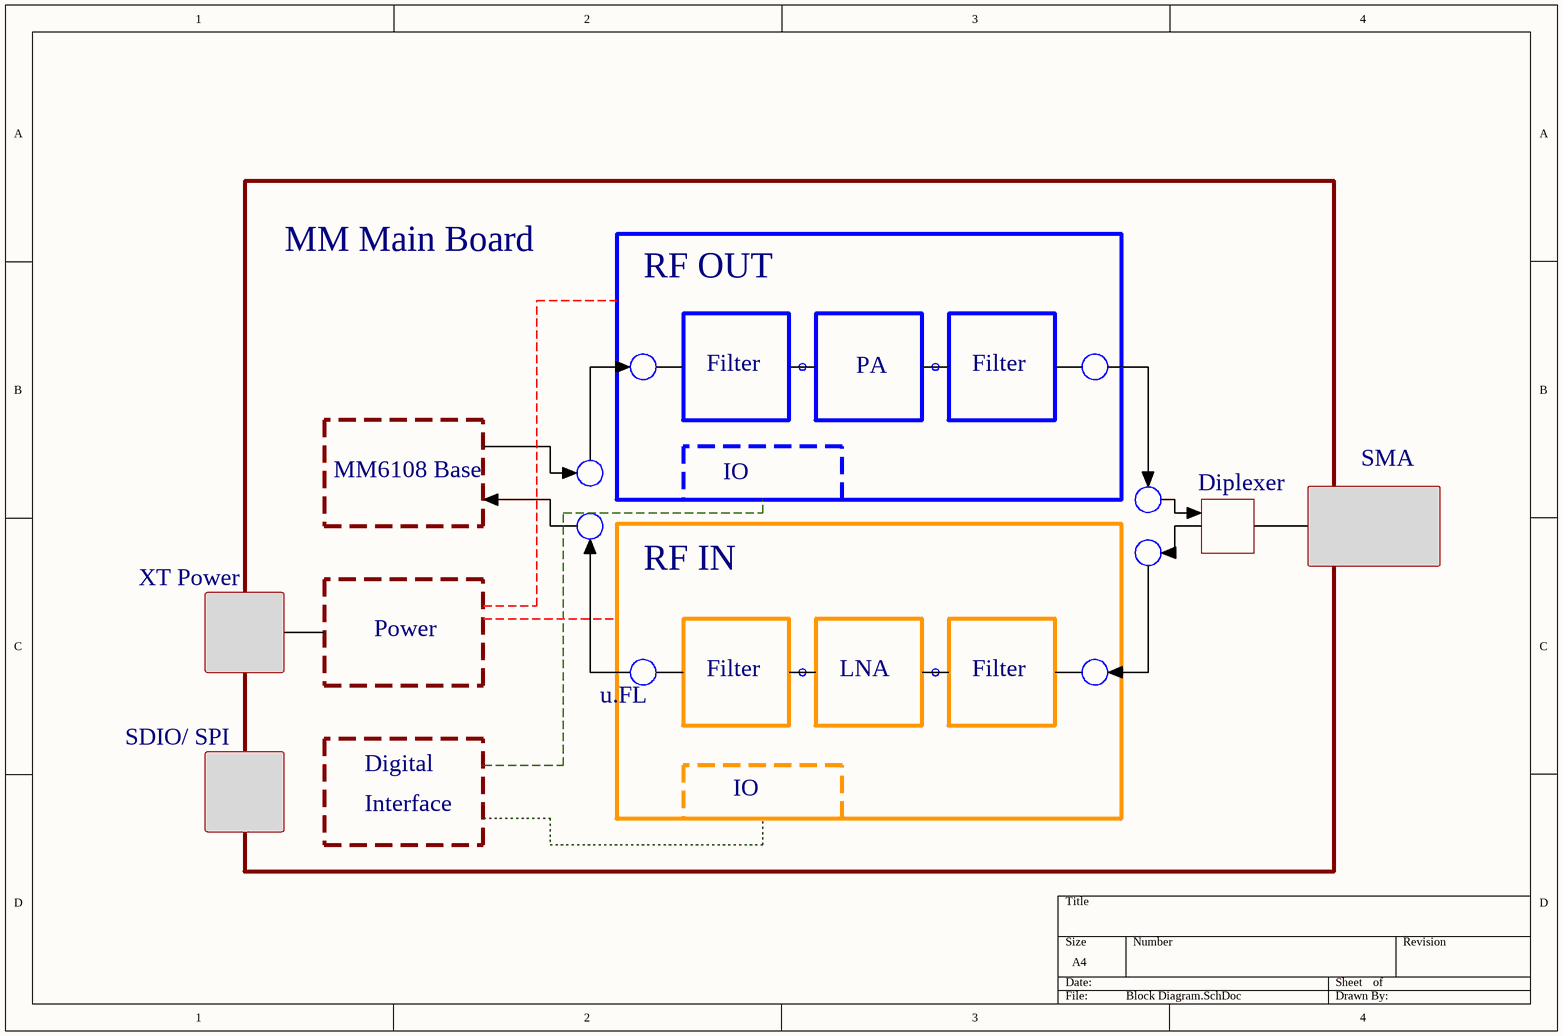
[diagram p3: Block Diagram.SchDoc]

### Notes on the sheet
- MM Main Board
- RF OUT
- Filter
- PA
- MM6108 Base
- IO
- Diplexer
- SMA
- RF IN
- XT Power
- Power
- u.FL
- LNA
- SDIO/ SPI
- Digital
- Interface

## Nets that join several sheets
GND: MM6108IQ Chip (40 pins), Power Management (17 pins)